# EAGLE design EC Shield (EAGLE 6.4)
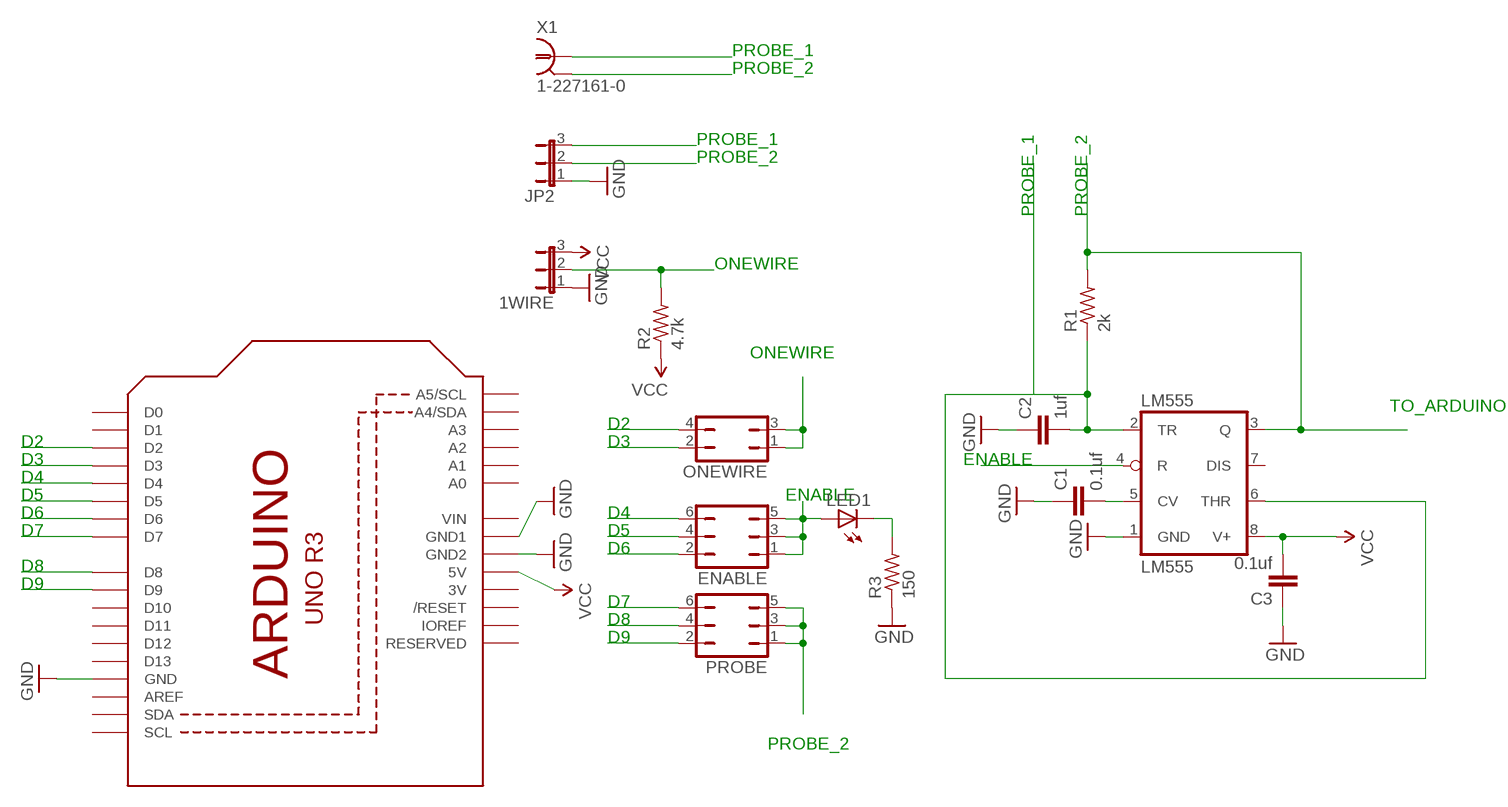
[diagram p0: schematic, sheet 1]

## Parts
1WIRE  JP2E  [JP2]
C1  0.1uf  C-EUC0603  [C0603]
C2  1uf  C-EUC0603  [C0603]
C3  0.1uf  C-EUC0603  [C0603]
ENABLE  JP3Q  [JP3Q]
JP2  JP2E  [JP2]
LED1  LED0603  [LED-0603]
LM555  LM555  LM555D  [SO08]
ONEWIRE  JP2Q  [JP2Q]
PROBE  JP3Q  [JP3Q]
R1  2k  R-US_R0603  [R0603]
R2  4.7k  R-US_R0603  [R0603]
R3  150  R-US_R0603  [R0603]
U2  ARDUINOR3-DIMENSION  [ARDUINOR3]
X1  1-227161-0  [AMP_227161]

## Nets
D2: ONEWIRE.4 U2.D2
D3: ONEWIRE.2 U2.D3
D4: ENABLE.6 U2.D4
D5: ENABLE.4 U2.D5
D6: ENABLE.2 U2.D6
D7: PROBE.6 U2.D7
D8: PROBE.4 U2.D8
D9: PROBE.2 U2.D9
ENABLE: ENABLE.1 ENABLE.3 ENABLE.5 LED1.A LM555.4(R)
GND: 1WIRE.1 C1.1 C2.1 C3.1 JP2.1 LM555.1(GND) R3.1 U2.GND U2.GND1 U2.GND2
N$1: C1.2 LM555.5(CV)
N$11: LED1.C R3.2
ONEWIRE: 1WIRE.2 ONEWIRE.1 ONEWIRE.3 R2.2
PROBE_1: C2.2 JP2.3 LM555.2(TR) LM555.6(THR) R1.1 X1.1
PROBE_2: JP2.2 LM555.3(Q) PROBE.1 PROBE.3 PROBE.5 R1.2 X1.2(GND)
VCC: 1WIRE.3 C3.2 LM555.8(V+) R2.1 U2.5V
Unconnected: LM555.7(DIS) U2.A0 U2.A1 U2.A2 U2.A3 U2.A4(A4/SDA) U2.A5(A5/SCL) U2.AREF U2.D0 U2.D1 U2.D10 U2.D11 U2.D12 U2.D13 U2.IOREF U2.RESERVED U2.RESET(/RESET) U2.SCL U2.SDA

## Notes on the sheet
- PROBE_1
- PROBE_2
- PROBE_1
- PROBE_2
- PROBE_1 | PROBE_2
- ONEWIRE
- ONEWIRE
- TO_ARDUINO
- D2
- D2 | D3
- D3 | ENABLE
- D4
- D5 | ENABLE
- D6 | D4
- D7 | D5
- D6
- D8
- D9
- D7
- D8
- D9
- PROBE_2

## Power pins joined to a net without a drawn wire
3V: U2.3V
VIN: U2.VIN

## Library data of the parts
1WIRE JP2 = jumper:JP2E: JUMPER
C1-C3 = resistor:C-EU: CAPACITOR, European symbol
ENABLE PROBE = jumper:JP3Q: JUMPER
LED1 = SparkFun:LED: LEDs Standard schematic elements and footprints for 5mm, 3mm, 1206, and 0603 sized LEDs. 5mm - Spark Fun Electronics SKU : COM-00529 (and others)
LM555 = linear:*555: TIMER
ONEWIRE = jumper:JP2Q: JUMPER
R1-R3 = rcl:R-US_: RESISTOR, American symbol
U2 = adafruit:ARDUINOR3: This is a new object for the new Arduino R3 - with extra pins that you may want to use (such as IOref, and duplicated A4/A5
X1 = con-coax:?227161*: JACK, RIGHT ANGLE, 50 OHM, PCB, BNC Source: amp_227161.pdf

## Board
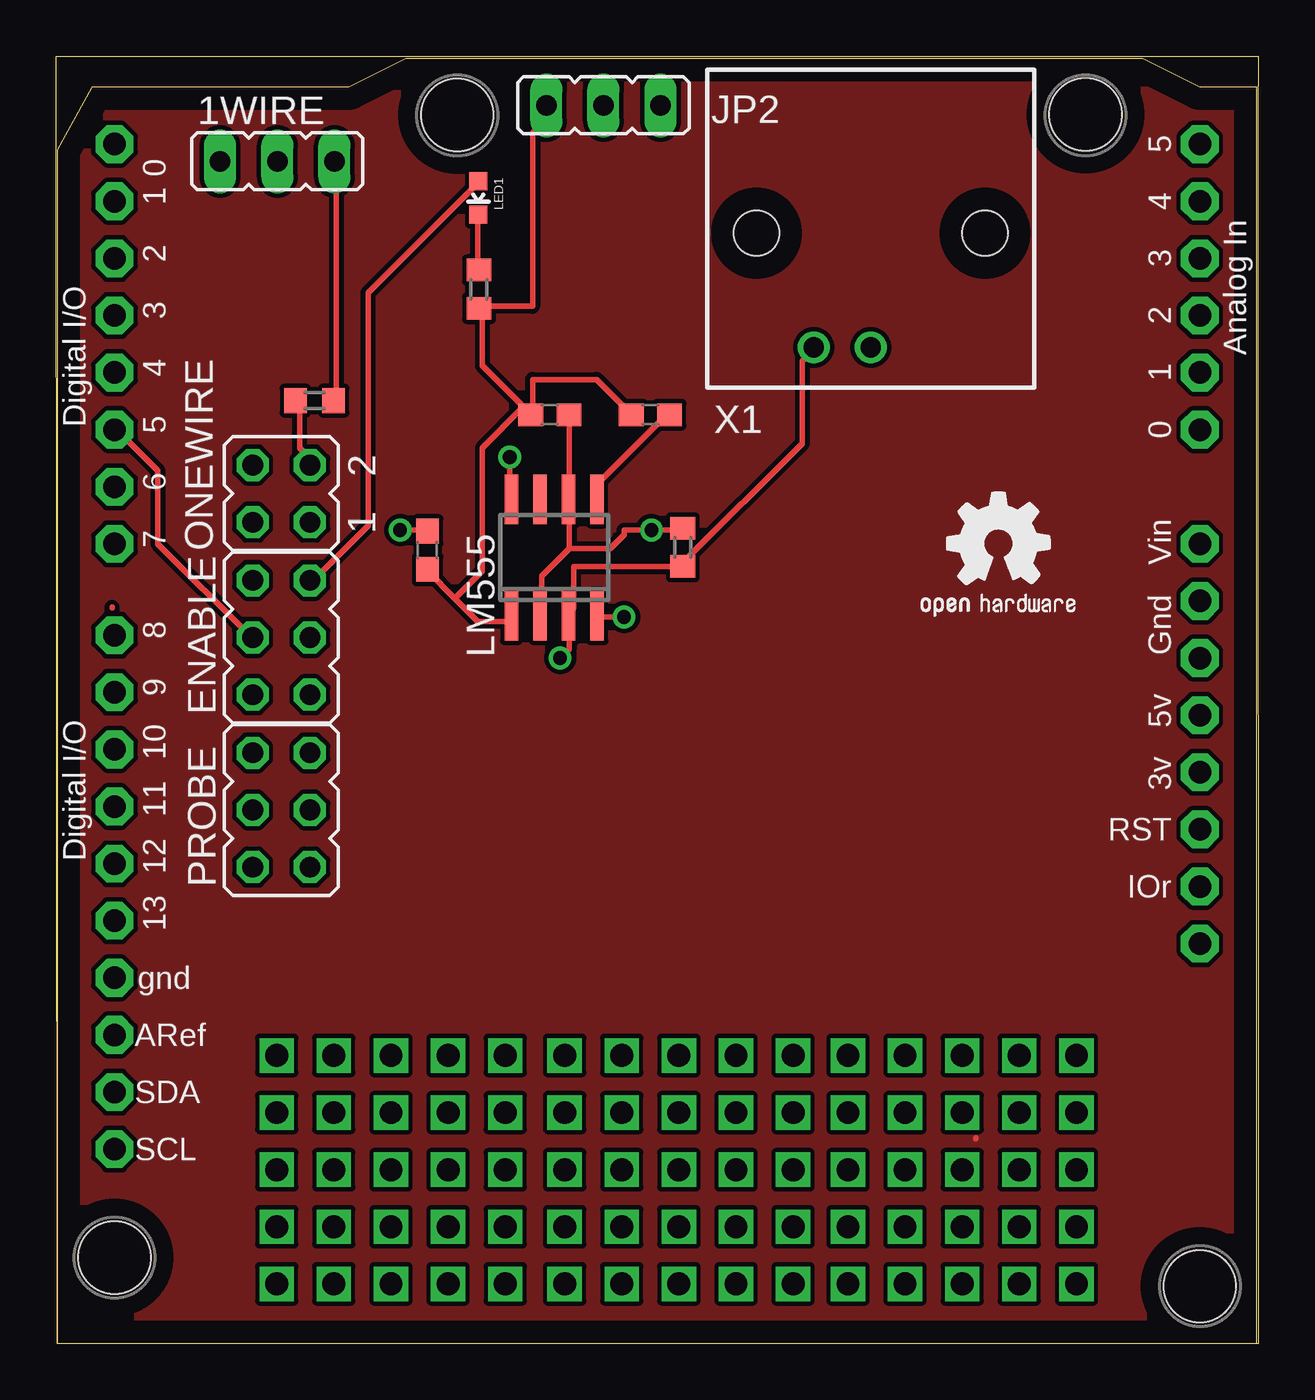
[diagram p1: board, top side]
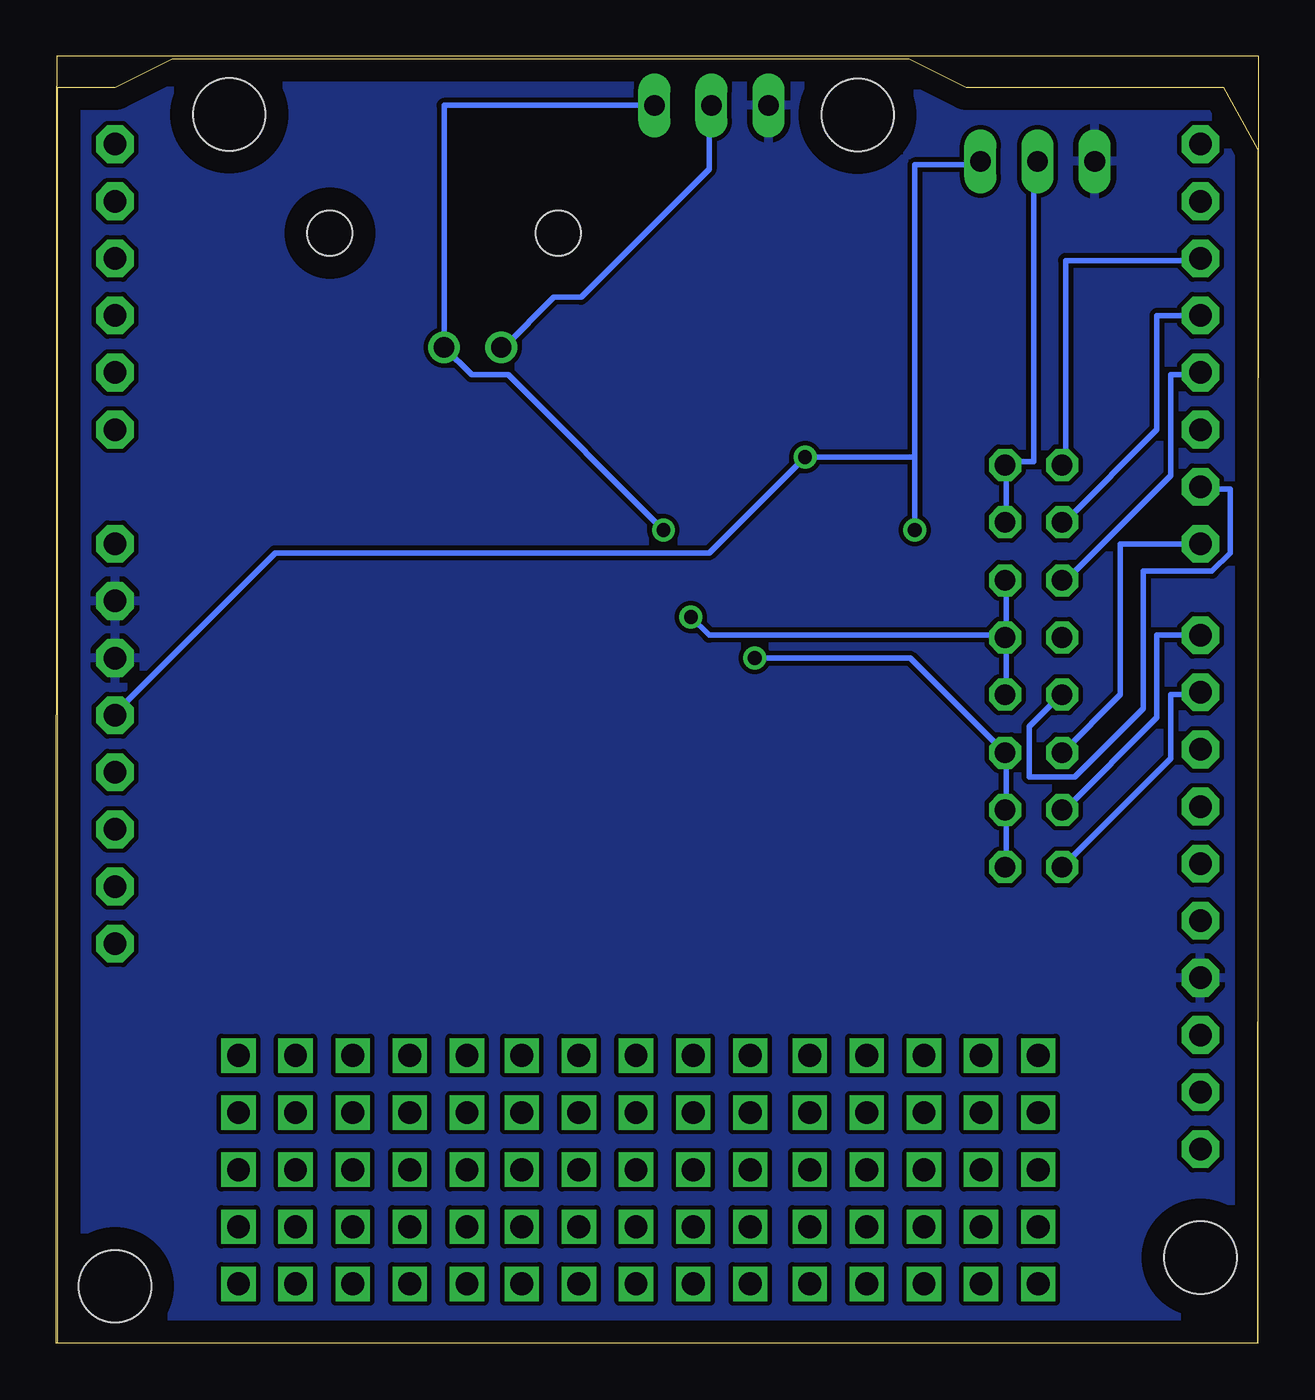
[diagram p2: board, bottom side, seen from below]

Size 53.47 x 57.25 mm. Coordinates in mm from the lower left corner, seen from the top.
Outline: 53.44,55.92 53.47,0 0.05,0 0,57.25 53.44,57.25 53.44,55.91
Copper layers (1*16): Top 0.035mm / dielectric 1.5mm / Bottom 0.035mm
Design rules "default": minimum track width 10mil, minimum drill 24mil, track to track 8mil, track to pad 8mil, pad to pad 8mil, via to via 8mil, smd to smd 8mil, copper to edge 40mil, drill to drill 8mil, minimum pad ring 10mil, minimum via ring 8mil, stop-mask expansion 4mil, vias tented up to drill 0mil, thermal gap 10mil
Holes 3.2 mm at 17.83,54.64 45.77,54.66 50.85,2.54 2.59,3.81

### Footprints (pad centres in the part's own frame; a part is rotated, then mirrored left to right if it is on the bottom)
JP2 = drill 0.914 long: 1 -2.54,0; 2 0,0; 3 2.54,0
C0603 = smd 1.1 x 1: 1 -0.85,0; 2 0.85,0
JP3Q = drill 0.914 octagon: 1 -2.54,-1.27; 2 -2.54,1.27; 3 0,-1.27; 4 0,1.27; 5 2.54,-1.27; 6 2.54,1.27
LED-0603 = smd 0.8 x 0.8: A 0,-0.75; C 0,0.75
SO08 = smd 0.6 x 2.2: 1 -1.905,-2.6; 2 -0.635,-2.6; 3 0.635,-2.6; 4 1.905,-2.6; 5 1.905,2.6; 6 0.635,2.6; 7 -0.635,2.6; 8 -1.905,2.6
JP2Q = drill 0.914 octagon: 1 -1.27,-1.27; 2 -1.27,1.27; 3 1.27,-1.27; 4 1.27,1.27
R0603 = smd 1 x 1.1: 1 -0.85,0; 2 0.85,0
ARDUINOR3 = drill 1 pad 1.676 octagon: 3V 25.4,2.54; 5V 27.94,2.54; A0 40.64,2.54; A1 43.18,2.54; A2 45.72,2.54; A3 48.26,2.54; A4 50.8,2.54; A5 53.34,2.54; AREF 13.716,50.8; D0 53.34,50.8; D1 50.8,50.8; D2 48.26,50.8; D3 45.72,50.8; D4 43.18,50.8; D5 40.64,50.8; D6 38.1,50.8; D7 35.56,50.8; D8 31.496,50.8; D9 28.956,50.8; D10 26.416,50.8; D11 23.876,50.8; D12 21.336,50.8; D13 18.796,50.8; GND 16.256,50.8; GND1 33.02,2.54; GND2 30.48,2.54; IOREF 20.32,2.54; RESERVED 17.78,2.54; RESET 22.86,2.54; SCL 8.636,50.8; SDA 11.176,50.8; VIN 35.56,2.54
PROTO_VIAS_05X05 = drill 1.016 square: 1 -5.08,5.08; 2 -2.54,5.08; 3 0,5.08; 4 2.54,5.08; 5 5.08,5.08; 6 -5.08,2.54; 7 -2.54,2.54; 8 0,2.54; 9 2.54,2.54; 10 5.08,2.54; 11 -5.08,0; 12 -2.54,0; 13 0,0; 14 2.54,0; 15 5.08,0; 16 -5.08,-2.54; 17 -2.54,-2.54; 18 0,-2.54; 19 2.54,-2.54; 20 5.08,-2.54; 21 -5.08,-5.08; 22 -2.54,-5.08; 23 0,-5.08; 24 2.54,-5.08; 25 5.08,-5.08
AMP_227161 = drill 0.9 pad 1.27: 1 0,-5.08; 2 -2.54,-5.08 | hole 2: -5.08,0; 5.08,0

### Placement (x,y rotation side)
1WIRE  9.83,52.58 0 top
C1  26.42,41.3 0 top
C2  21.95,41.3 0 top
C3  16.51,35.28 90 top
ENABLE  10.01,31.39 90 top
JP2  24.33,55.07 0 top
LED1  18.77,50.95 180 top
LM555  22.15,34.95 0 top
ONEWIRE  10.01,37.8 90 top
PROBE  10.01,23.72 90 top
R1  27.86,35.41 270 top
R2  11.48,41.94 180 top
R3  18.8,46.89 90 top
U2  53.39,0 90 top
U$1  [OSHW2]  38.07,31.29 0 top
U$2  PROTO_VIAS_05X05  [PROTO_VIAS_05X05]  14.88,7.72 0 top
U$3  PROTO_VIAS_05X05  [PROTO_VIAS_05X05]  27.69,7.72 0 top
U$4  PROTO_VIAS_05X05  [PROTO_VIAS_05X05]  40.28,7.72 0 top
X1  36.22,49.38 0 top

### Tracks (layer width: path | path; a pad name or v marks a point on that pad's centre or on a via)
D2
  Bottom 0.254: ONEWIRE.4 8.58,39.22 8.58,48.16 2.69,48.16 U2.D2
D3
  Bottom 0.254: U2.D3 4.52,45.72 4.52,40.64 8.58,36.58 ONEWIRE.2
D4
  Bottom 0.254: ENABLE.6 8.58,33.93 3.91,38.61 3.91,43.08 2.69,43.08 U2.D4
D5
  Top 0.254: ENABLE.4 8.58,31.5 4.52,35.56 4.52,38.81 2.69,40.64 U2.D5
D6
  Bottom 0.254: ENABLE.2 8.79,28.85 10.21,27.43 10.21,25.2 8.18,25.2 5.13,28.25 5.13,34.34 2.08,34.34 1.27,35.15 1.27,38 2.49,38 U2.D6
D7
  Bottom 0.254: PROBE.6 6.15,28.85 6.15,35.56 U2.D7
D8
  Bottom 0.254: U2.D8 4.52,31.5 4.52,27.84 8.58,23.77 PROBE.4
D9
  Bottom 0.254: PROBE.2 3.91,26.01 3.91,28.85 2.69,28.85 U2.D9
ENABLE  (via drill 0.61)
  Top 0.254: v25.25,32.31 24.23,32.31 LM555.4 | LED1.A 18.74,51.61 13.87,46.74 13.87,36.37 11.43,33.93 ENABLE.5
  Bottom 0.254: v25.25,32.31 24.43,31.5 11.43,31.5 ENABLE.3 | ENABLE.1 11.23,28.85 11.23,31.29 ENABLE.3 | ENABLE.3 11.23,31.5 11.23,33.93 ENABLE.5
GND
  Top 0.254: 17.73,33.12 18.74,32.11 20.17,32.11 20.17,32.31 LM555.1 | 17.73,33.12 16.51,34.34 C3.1 | 20.78,41.66 18.95,43.48 18.95,45.92 R3.1 18.95,46.13 21.18,46.13 21.18,53.85 21.79,54.46 JP2.1 | 20.78,41.66 20.98,41.45 C2.1 | C1.1 25.45,41.45 24.03,42.88 21.18,42.88 21.18,41.45 C2.1 | 17.73,33.12 18.95,34.34 18.95,39.83 20.78,41.66 | 20.78,41.66 C2.1
  pour Bottom: 0.18,57.05 53.47,57.1 53.39,0.15 0.1,0.1
N$1
  Top 0.254: C1.2 27.08,41.25 24.03,38.2 24.03,37.59 LM555.5
N$2
  Top 0.254: 2.49,32.72 2.49,32.74
N$3
  Top 0.254: 40.89,9.14 40.89,9.09
  pour Top: 0.13,57.1 53.47,57.07 53.39,0.13 0.05,0.15
N$11
  Top 0.254: LED1.C 18.74,50.19 18.74,47.75 R3.2
ONEWIRE
  Top 0.254: R2.2 10.82,41.86 10.82,39.83 11.23,39.42 11.23,39.22 ONEWIRE.3
  Bottom 0.254: 1WIRE.2 10.01,52.43 10.01,39.22 11.23,39.22 ONEWIRE.3 11.23,39.01 11.23,36.58 ONEWIRE.1
PROBE_1  (via drill 0.61)
  Top 0.254: C2.2 22.81,41.25 22.81,37.59 LM555.6 22.81,37.39 22.81,35.36 | 22.81,35.36 24.64,35.36 25.25,35.97 25.25,36.17 v26.47,36.17 27.69,36.17 R1.1 | 22.81,35.36 21.59,34.14 21.59,32.51 LM555.2
  Bottom 0.254: JP2.3 36.22,55.07 X1.1 35,43.08 33.38,43.08 v26.47,36.17
PROBE_2  (via drill 0.61)
  Top 0.254: X1.2 33.58,44.3 33.58,44.09 33.17,43.69 33.17,40.03 27.89,34.75 R1.2 27.69,34.54 23.01,34.54 23.01,32.72 22.81,32.51 LM555.3 22.81,32.31 22.81,30.89 v22.4,30.48
  Bottom 0.254: PROBE.1 11.23,21.34 11.23,23.57 PROBE.3 11.23,23.77 11.23,26.21 PROBE.5 15.49,30.48 v22.4,30.48 | X1.2 33.58,44.3 31.34,46.53 30.12,46.53 24.43,52.22 24.43,55.07 JP2.2
VCC  (via drill 0.61)
  Top 0.254: v15.29,36.17 16.51,36.17 C3.2 | R2.1 12.45,42.06 12.45,52.43 1WIRE.3 | v20.17,39.42 20.17,37.59 LM555.8
  Bottom 0.254: 15.29,39.42 15.29,52.43 12.45,52.43 1WIRE.3 | 15.29,39.42 v15.29,36.17 | 15.29,39.42 v20.17,39.42 24.43,35.15 43.74,35.15 50.85,28.04 U2.5V

### Text on the board
tValues: GND | GND | VCC | GND | DATA | PROBE | PROBE | v1.1 | practicalmaker.com